# EAGLE design Interfaz Motor Maxon (EAGLE 9.6.2)
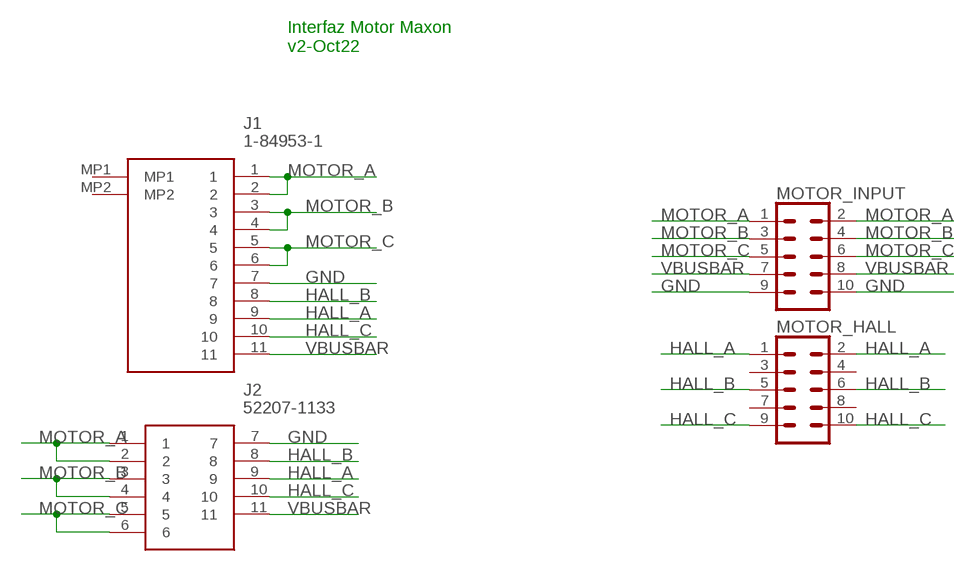
[diagram p0: schematic, sheet 1]

## Parts
J1  1-84953-1  [1849531]
J2  52207-1133  [52207-1133]
MOTOR_HALL  CONN_05X2PTH  [2X5]
MOTOR_INPUT  CONN_05X2PTH  [2X5]

## Nets
GND: J1.7 J2.7 MOTOR_INPUT.9 MOTOR_INPUT.10
HALL_A: J1.9 J2.9 MOTOR_HALL.1 MOTOR_HALL.2
HALL_B: J1.8 J2.8 MOTOR_HALL.5 MOTOR_HALL.6
HALL_C: J1.10 J2.10 MOTOR_HALL.9 MOTOR_HALL.10
MOTOR_A: J1.1 J1.2 J2.1 J2.2 MOTOR_INPUT.1 MOTOR_INPUT.2
MOTOR_B: J1.3 J1.4 J2.3 J2.4 MOTOR_INPUT.3 MOTOR_INPUT.4
MOTOR_C: J1.5 J1.6 J2.5 J2.6 MOTOR_INPUT.5 MOTOR_INPUT.6
VBUSBAR: J1.11 J2.11 MOTOR_INPUT.7 MOTOR_INPUT.8
Unconnected: J1.MP1 J1.MP2 MOTOR_HALL.3 MOTOR_HALL.4 MOTOR_HALL.7 MOTOR_HALL.8

## Notes on the sheet
- Interfaz Motor Maxon
  v2-Oct22

## Library data of the parts
J1 = 1-84953-1:1-84953-1: 1MM FPC HORZ.TOP CONT.ASSY 11P Source: Datasheet <https://www.te.com/commerce/DocumentDelivery/DDEController?Action=showdoc&DocId=Customer Drawing84953A3pdfEnglishENG_CD_84953_A3.pdf1-84953-5>; ARROW_PART_NUMBER: 1-84953-1; ARROW_PRICE-STOCK: https://www.arrow.com/en/products/1-84953-1/te-connectivity?region=nac; DESCRIPTION: 1MM FPC HORZ.TOP CONT.ASSY 11P; HEIGHT: 2.74mm; MANUFACTURER_NAME: TE Connectivity; MANUFACTURER_PART_NUMBER: 1-84953-1; MOUSER_PART_NUMBER: 571-1-84953-1; MOUSER_PRICE-STOCK: https://www.mouser.co.uk/ProductDetail/TE-Connectivity/1-84953-1?qs=uUkeXfjQ8uQbyHjuXR99Yw%3D%3D
J2 = 52207-1133:52207-1133: FFC & FPC Connectors 1.0 FPC ZIF 11Ckt Sn-Ag-Bi Source: Datasheet <http://www.molex.com/pdm_docs/sd/522072033_sd.pdf>; DESCRIPTION: FFC & FPC Connectors 1.0 FPC ZIF 11Ckt Sn-Ag-Bi; HEIGHT: mm; MANUFACTURER_NAME: Molex; MANUFACTURER_PART_NUMBER: 52207-1133; MOUSER_PART_NUMBER: 538-52207-1133; MOUSER_PRICE-STOCK: https://www.mouser.co.uk/ProductDetail/Molex/52207-1133?qs=rw2VfpiI%2FsMfVoKouvnHSg%3D%3D
MOTOR_HALL MOTOR_INPUT = SparkFun-Connectors:CONN_05X2: Multi connection point. Often used as Generic Header-pin footprint for 0.1 inch spaced/style header connections For AVR SPI programming port, see special device with nice symbol: "AVR_SPI_PROG_5x2.dev" You can populate with any combo of single row headers, but if you'd like an exact match, check these: 2x5 AVR ICSP Male Header <https://www.sparkfun.com/products/778> (PRT-00778) 2x5 Pin Shrouded Header <https://www.sparkfun.com/products/8506> (PRT-08506) On any of the 0.1 inch spaced packages, you can populate with these: Break Away Headers - Straight <https://www.sparkfun.com/products/116> (PRT-00116) Break Away Male Headers - Right Angle <https://www.sparkfun.com/products/553> (PRT-00553) Female Headers <https://www.sparkfun.com/products/115> (PRT-00115) Break Away Headers - Machine Pin <https://www.sparkfun.com/products/117> (PRT-00117) Break Away Female Headers - Swiss Machine Pin <https://www.sparkfun.com/products/743> (PRT-00743) Special note: the shrouded connector mates well with our 5x2 ribbon cables: 2x5 Pin IDC Ribbon Cable <https://www.sparkfun.com/products/8535> (PRT-08535); PROD_ID: CONN-08499; SF_ID: PRT-0778

## Board
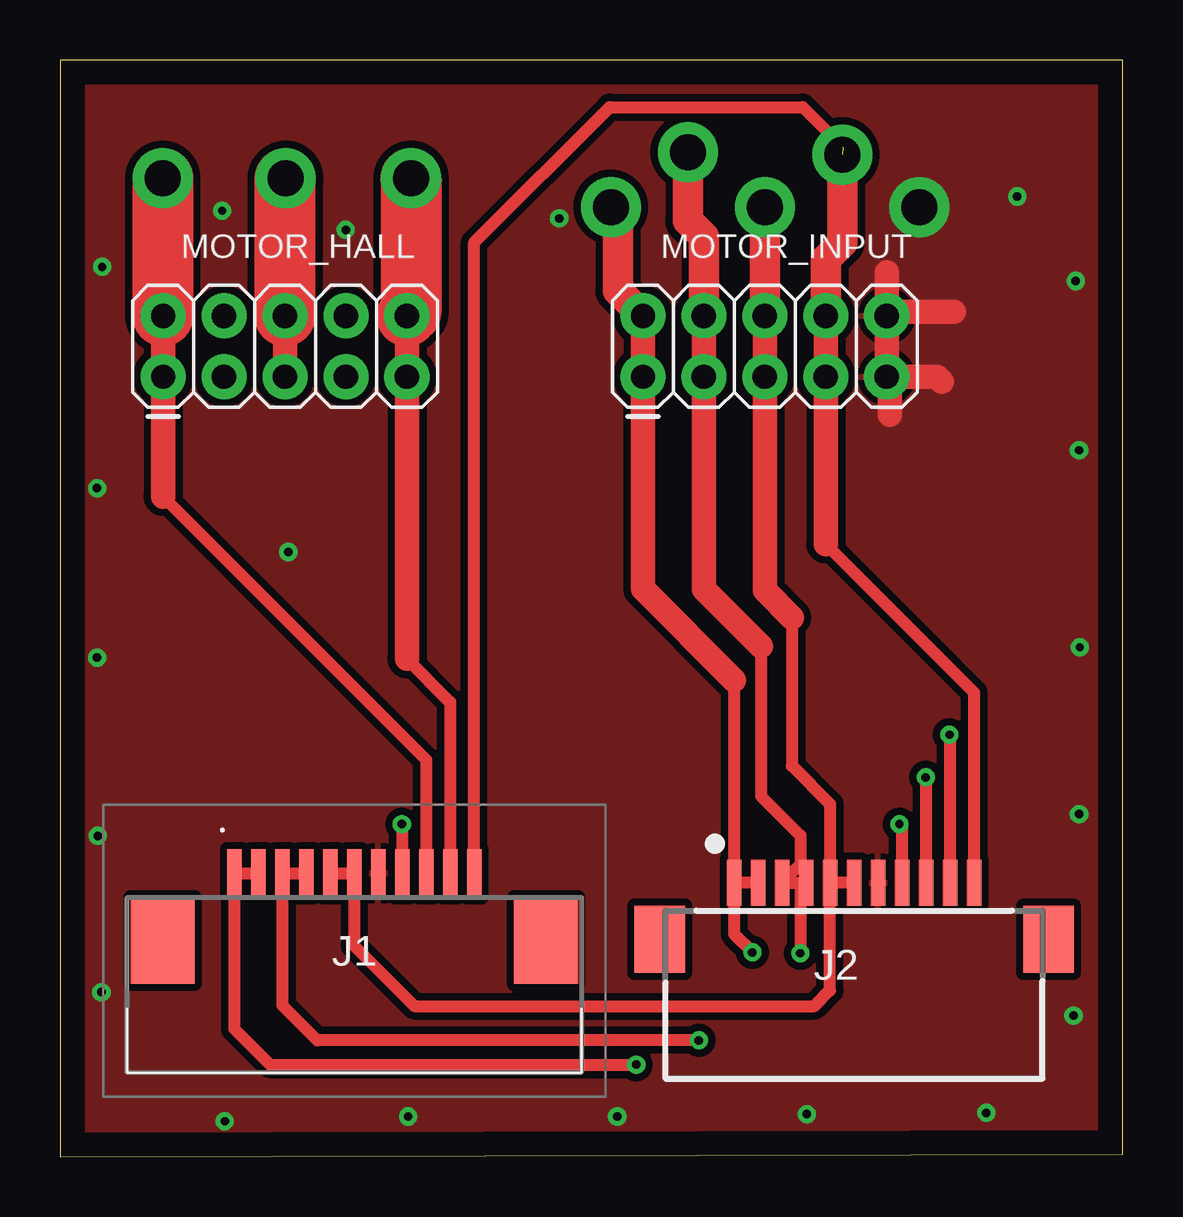
[diagram p1: board, top side]
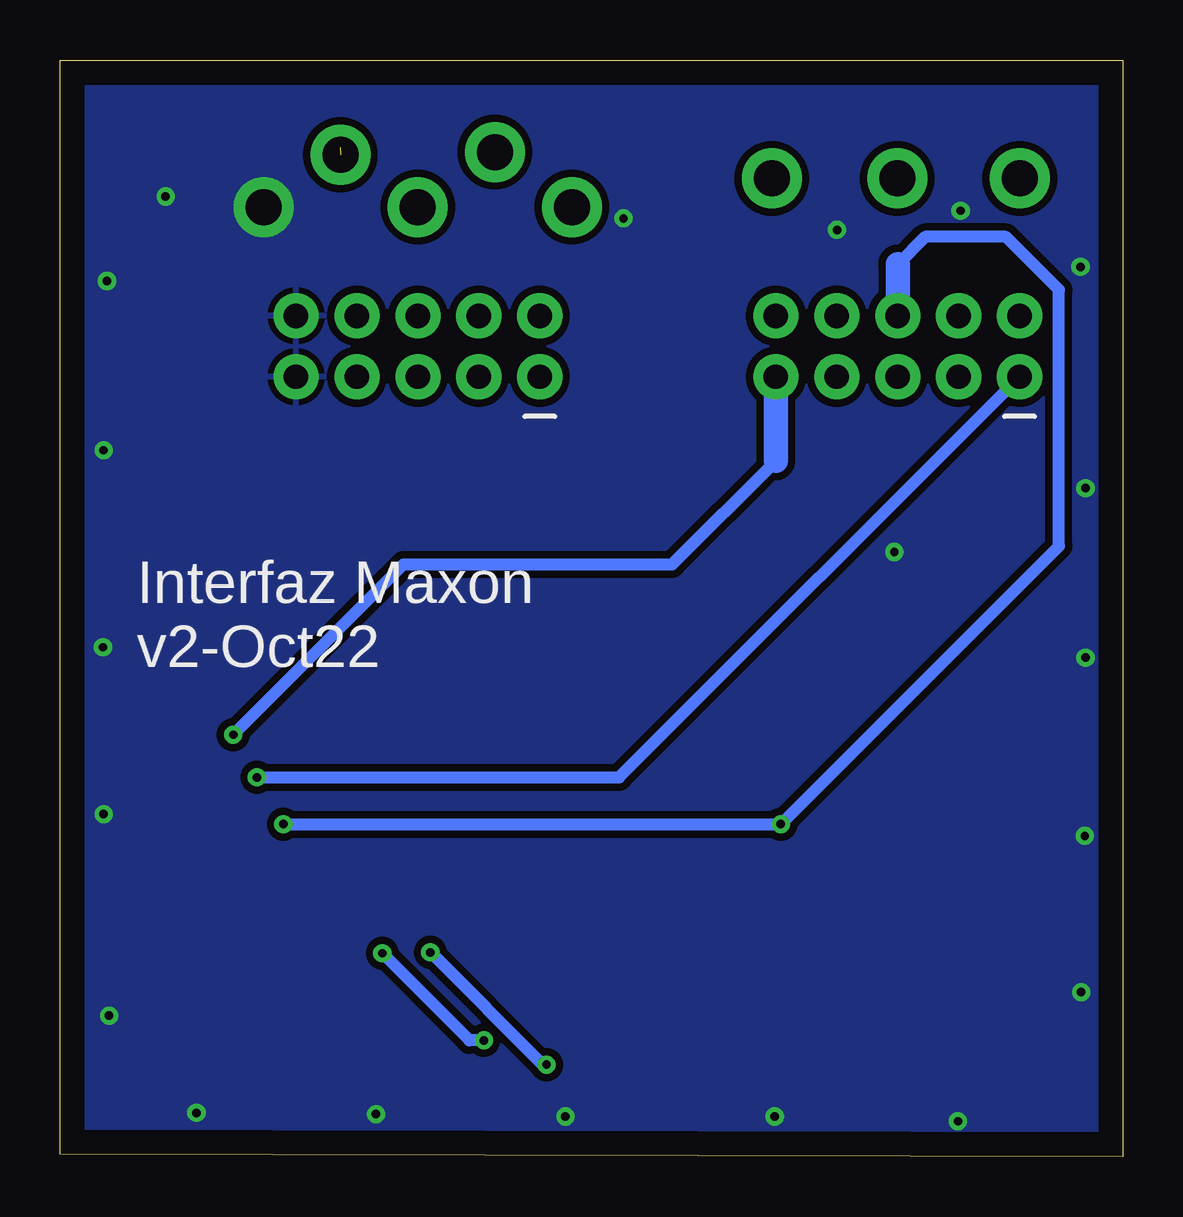
[diagram p2: board, bottom side, seen from below]

Size 44.3 x 45.7 mm. Coordinates in mm from the lower left corner, seen from the top.
Outline: 0,0 44.3,0.1 44.3,45.69 0,45.7 0,0
Copper layers (1*16): Top 0.035mm / dielectric 1.5mm / Bottom 0.035mm
Design rules "default *": minimum track width 6mil, minimum drill 0.35mm, track to track 12mil, track to pad 12mil, pad to pad 12mil, via to via 12mil, smd to smd 6mil, copper to edge 40mil, drill to drill 6mil, minimum pad ring 10mil, minimum via ring 8mil, stop-mask expansion 4mil, vias tented up to drill 0mil, thermal gap 10mil

### Footprints (pad centres in the part's own frame; a part is rotated, then mirrored left to right if it is on the bottom)
1849531 = smd 0.61 x 2: 1 -5,4.15; 2 -4,4.15; 3 -3,4.15; 4 -2,4.15; 5 -1,4.15; 6 0,4.15; 7 1,4.15; 8 2,4.15; 9 3,4.15; 10 4,4.15; 11 5,4.15 | smd 2.68 x 3.6: MP1 -7.99,1.35; MP2 7.99,1.35
52207-1133 = smd 0.6 x 1.9: 1 -5,0; 2 -4,0; 3 -3,0; 4 -2,0; 5 -1,0; 6 0,0; 7 1,0; 8 2,0; 9 3,0; 10 4,0; 11 5,0 | smd 2.1 x 2.8: 12 -8.105,-2.35; 13 8.105,-2.35
2X5 = drill 1.016 pad 1.88: 1 0,0; 2 0,2.54; 3 2.54,0; 4 2.54,2.54; 5 5.08,0; 6 5.08,2.54; 7 7.62,0; 8 7.62,2.54; 9 10.16,0; 10 10.16,2.54

### Placement (x,y rotation side)
J1  12.27,7.66 0 top
J2  33.1,11.42 0 top
MOTOR_HALL  4.3,32.5 0 top
MOTOR_INPUT  24.3,32.5 0 top

### Tracks (layer width: path | path; a pad name or v marks a point on that pad's centre or on a via)
GND  (via drill 0.35, 1.5 pad 2.5)
  Top 1.016: MOTOR_INPUT.9 36.56,32.5 36.77,32.29 | MOTOR_INPUT.9 34.59,32.37 34.59,30.91 | MOTOR_INPUT.9 MOTOR_INPUT.10 | MOTOR_INPUT.10 34.46,36.85 34.47,36.86 | MOTOR_INPUT.10 34.63,35.21 37.26,35.21
  other vias: 1.76,37.08 1.55,27.86 1.55,20.8 1.58,13.37 1.73,6.86 6.87,1.48 14.51,1.68 23.23,1.68 31.13,1.78 38.61,1.83 42.25,5.88 42.48,14.28 42.51,21.23 42.48,29.44 42.34,36.49 39.9,40.01 6.76,39.42 20.81,39.1 11.91,38.62 9.52,25.2 35.82,39.58
  pour Top: -1.8,45.12 45.3,45.12 45.3,-0.5 -1.8,-0.5
  pour Bottom: -1.4,45.11 45.3,45.11 45.3,-0.5 -1.4,-0.5
HALL_A  (via drill 0.35, 1.5 pad 2.5)
  Top 0.508: J1.9 15.27,16.54 4.3,27.51 | v36.09,15.81 v36.1,15.8 J2.9
  Top 1.016: MOTOR_HALL.2 MOTOR_HALL.1 4.3,27.51
  Top 2.54: v4.29,40.77 MOTOR_HALL.2
  Bottom 0.508: v36.09,15.81 20.99,15.81 MOTOR_HALL.1
HALL_B  (via drill 0.35, 1.5 pad 2.5)
  Top 0.508: v14.25,13.86 14.27,13.84 J1.8 | v34.99,13.86 35.1,13.75 J2.8
  Top 1.016: MOTOR_HALL.6 MOTOR_HALL.5
  Top 2.54: MOTOR_HALL.6 9.38,40.75 v9.4,40.77
  Bottom 0.508: v34.99,13.86 v14.25,13.86 2.66,25.45 2.66,36.12 4.87,38.33 8.24,38.33 9.38,37.19
  Bottom 1.016: 9.38,37.19 MOTOR_HALL.6
HALL_C  (via drill 0.35, 1.5 pad 2.5)
  Top 0.508: 14.46,20.75 16.27,18.94 J1.10 | v37.08,17.59 37.1,17.57 J2.10
  Top 1.016: MOTOR_HALL.10 MOTOR_HALL.9 14.46,20.75
  Top 2.54: v14.63,40.77 14.63,35.21 MOTOR_HALL.10
  Bottom 0.508: v37.08,17.59 29.98,24.68 18.78,24.68 14.46,29
  Bottom 1.016: 14.46,29 MOTOR_HALL.9
MOTOR_A  (via drill 0.35, 1.5 pad 2.5)
  Top 0.508: 28.1,19.86 J2.1 | J2.2 J2.1 | J1.2 J1.1 7.27,5.33 8.76,3.84 v24.02,3.84 | J2.1 28.1,9.28 v28.86,8.52
  Top 1.016: MOTOR_INPUT.2 MOTOR_INPUT.1 24.3,23.66 28.1,19.86
  Top 1.27: MOTOR_INPUT.2 23.25,36.09 23.25,39.28 v22.96,39.58
  Bottom 0.508: v28.86,8.52 24.18,3.84 v24.02,3.84
MOTOR_B  (via drill 0.35, 1.5 pad 2.5)
  Top 0.508: 29.22,21.27 29.22,15.03 30.87,13.38 30.87,12.19 J2.3 J2.4 31.01,11.42 30.86,11.27 v30.86,8.48 | J1.4 J1.3 9.27,6.31 10.73,4.85 v26.63,4.85
  Top 1.016: MOTOR_INPUT.4 MOTOR_INPUT.3 26.84,23.65 29.22,21.27
  Top 1.27: v26.18,41.86 26.18,38.99 26.84,38.33 MOTOR_INPUT.4
  Bottom 0.508: v30.86,8.48 27.23,4.85 v26.63,4.85
MOTOR_C  (via drill 1.5 pad 2.5)
  Top 0.508: 30.51,22.47 30.51,16.29 32.1,14.7 J2.5 | J2.5 32.1,6.93 31.45,6.28 14.78,6.28 12.27,8.79 J1.6 J1.5 | J2.6 J2.5
  Top 1.016: MOTOR_INPUT.6 MOTOR_INPUT.5 29.38,23.6 30.51,22.47
  Top 1.27: MOTOR_INPUT.6 v29.39,39.58
VBUSBAR  (via drill 1.5 pad 2.5)  (1 unrouted)
  Top 0.508: J2.11 38.1,19.35 31.92,25.53 | J1.11 17.27,38.09 22.92,43.74 30.96,43.74 32.63,42.07
  Top 1.016: MOTOR_INPUT.8 MOTOR_INPUT.7 31.92,25.53
  Top 1.27: MOTOR_INPUT.8 31.92,37.4 32.6,38.09 v32.6,41.75

### Text on the board
bPlace: Interfaz Maxon / v2-Oct22